# EasyEDA schematic SCH_acpi-pcb-design.json
TITLE: ACPI V3 - Brazalete; REV: 1.0; Date: 2026-09-23; Sheet: 1/1; Drawn By: Edy S. Avila; Company: Edy S. Avila
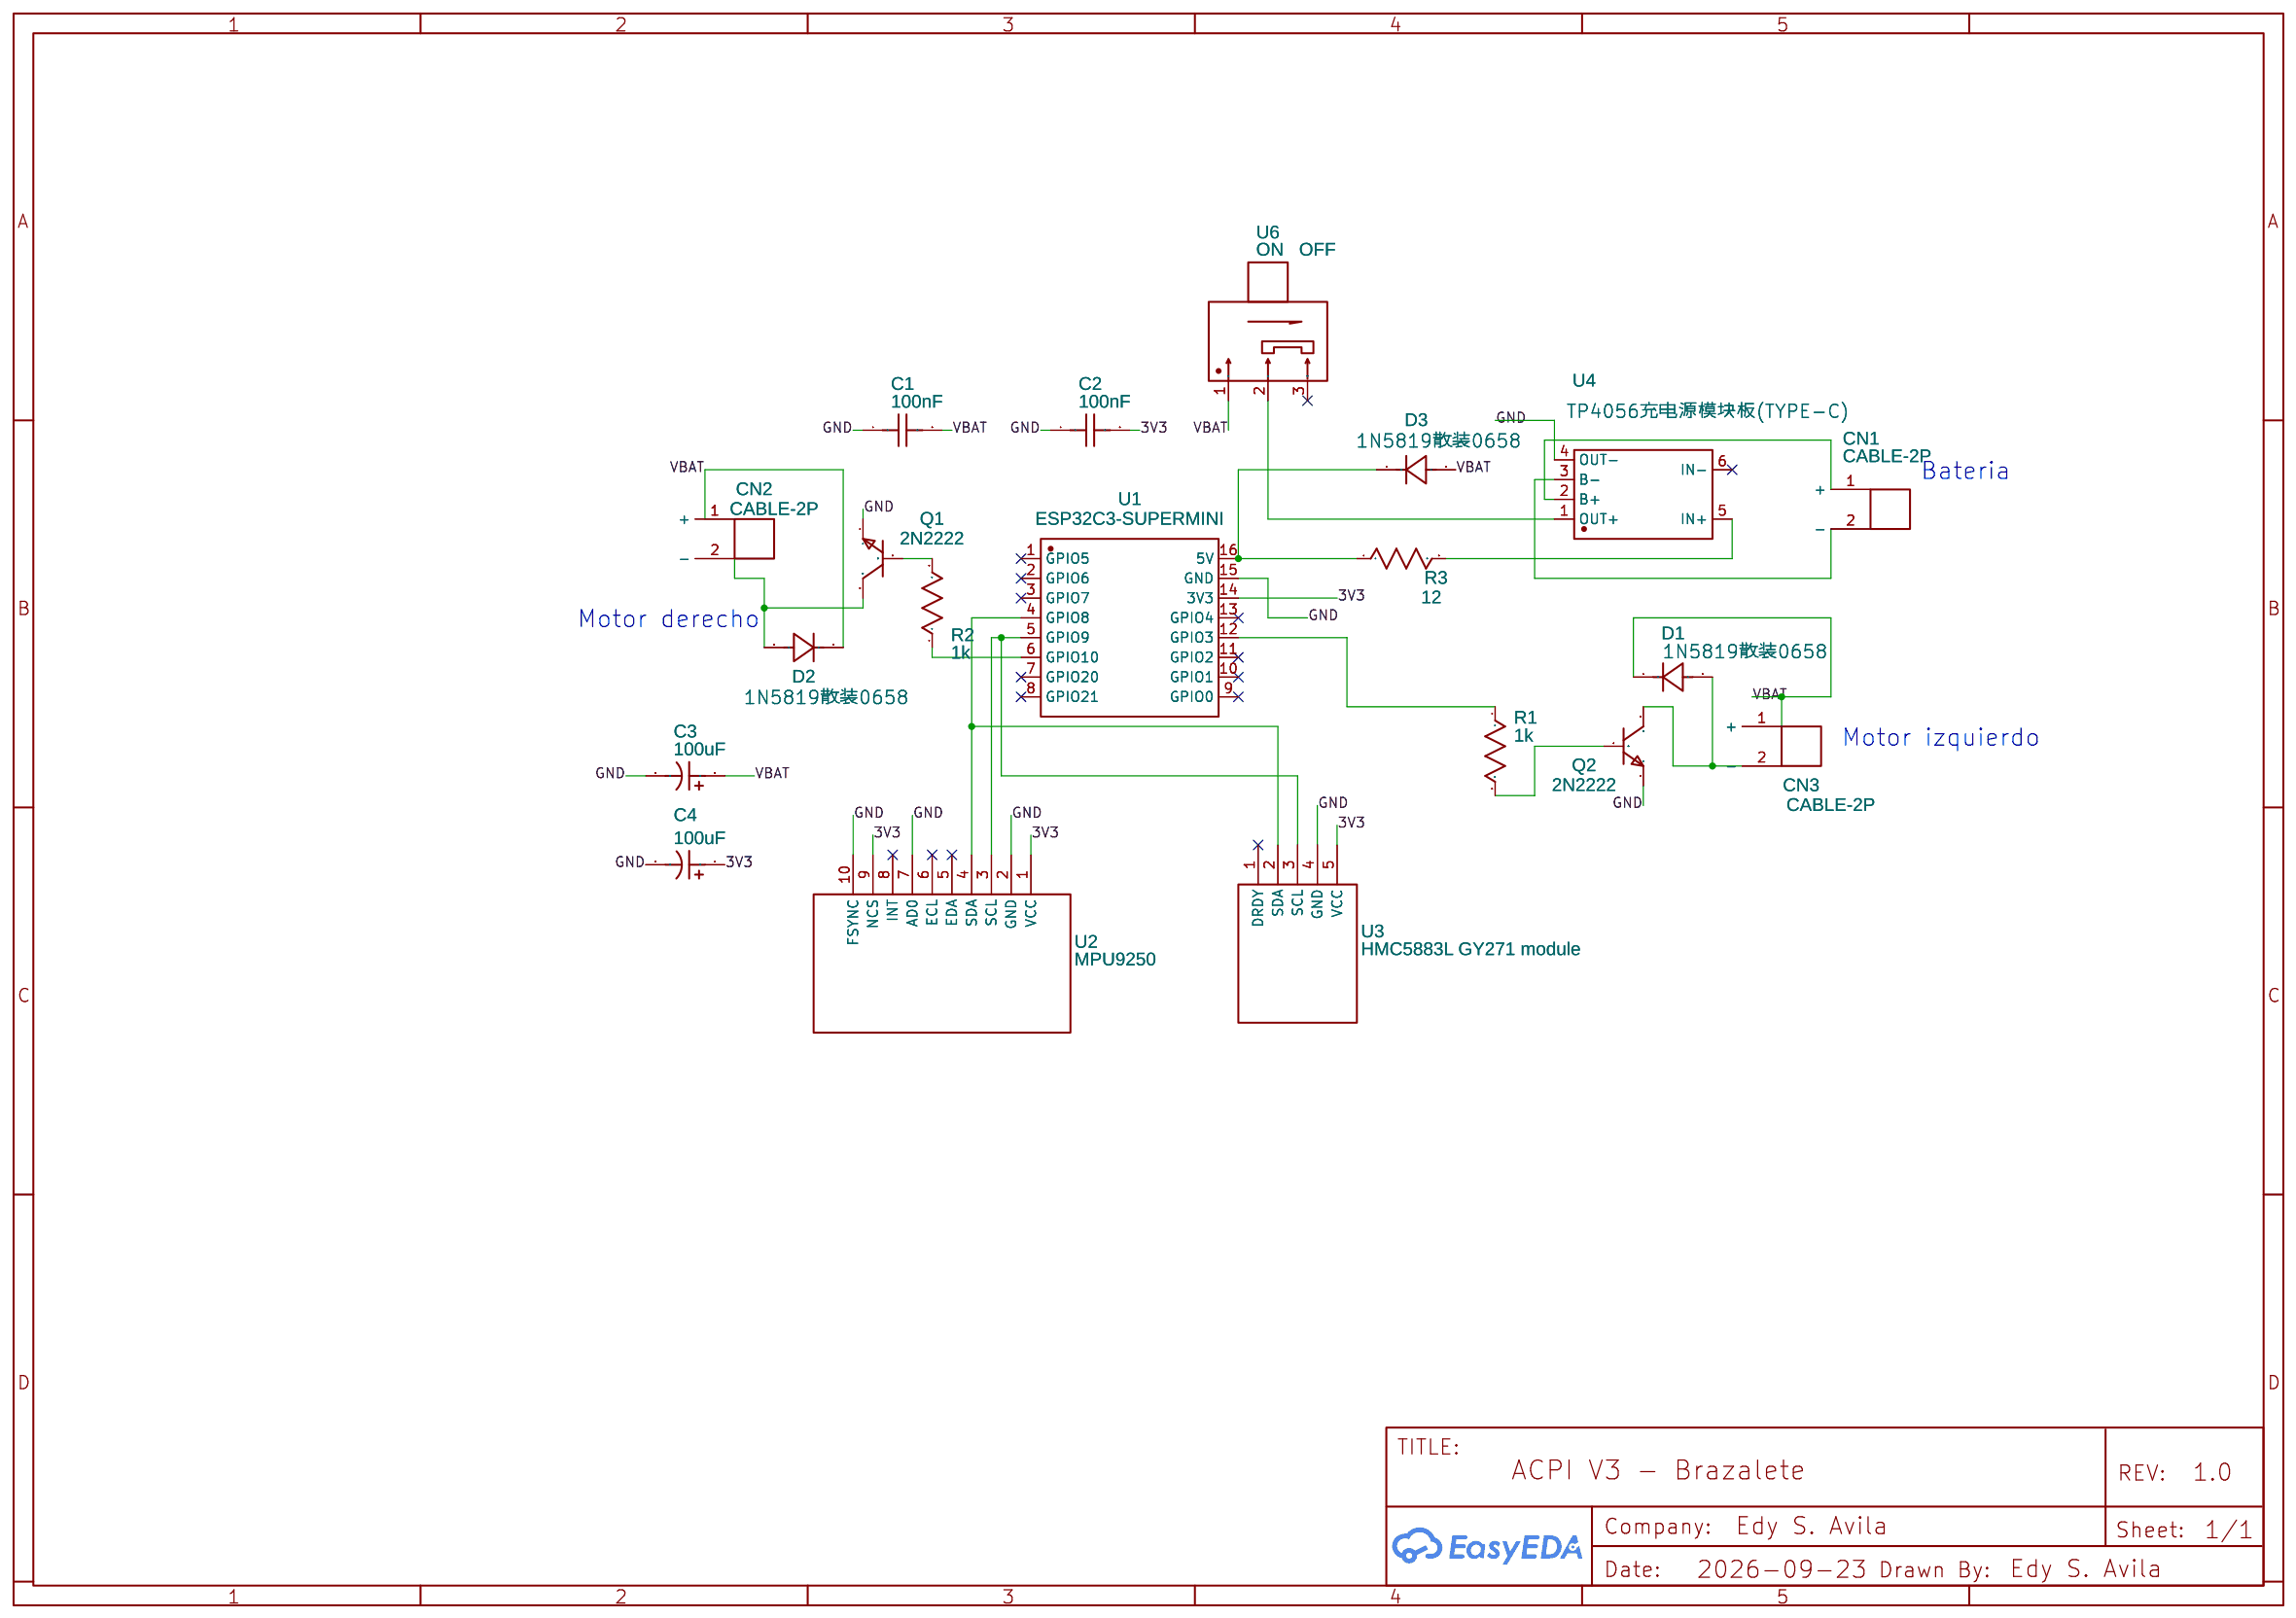
[diagram p0: schematic sheet]

## Parts
C1  100nF  [CAP-TH_L5.0-W2.5-P5.08-D0.7]
C2  100nF  [CAP-TH_L5.0-W2.5-P5.08-D0.7]
C3  100uF  [CAP-TH_BD6.3-P2.50-D0.6-FD]
C4  100uF  [CAP-TH_BD6.3-P2.50-D0.6-FD]
CN1  CABLE-2P  [CABLE-2P-P3.81]
CN2  CABLE-2P  [CABLE-2P-P3.81]
CN3  CABLE-2P  [CABLE-2P-P3.81]
D1  1N5819散装0658  [DO-41_BD2.4-L4.7-P8.70-D0.9-RD]
D2  1N5819散装0658  [DO-41_BD2.4-L4.7-P8.70-D0.9-RD]
D3  1N5819散装0658  [DO-41_BD2.4-L4.7-P8.70-D0.9-RD]
Q1  2N2222  [TO-92-P2.54-CASERA]
Q2  2N2222  [TO-92-P2.54-CASERA]
R1  1k  [R_AXIAL-0.3]
R2  1k  [R_AXIAL-0.3]
R3  12  [R_AXIAL-0.5]
U1  ESP32C3-SUPERMINI  [ESP32C3-SUPERMINI-THT]
U2  MPU9250  [MPU9250]
U3  HMC5883L GY271 module  [HMC5883L GY271 MODULE]
U4  TP4056充电源模块板(TYPE-C)  [PWRM-TH_TP4056]
U6  ON   OFF  [SW-TH_SS12D00G4]

## Library data of the parts
C1 C2 = CC2A104ZC1ID3F7C30MF: Contributor: LCSC; Supplier: LCSC; Supplier Part: C254109; Manufacturer: Dersonic(德尔创); JLCPCB Part Class: Extended Part
C3 C4 = OLKC1102A220MF: Supplier: LCSC; Supplier Part: C19193647; Manufacturer: Ymin(永铭); Contributor: lcsc
CN1-CN3 = CABLE-2P: Contributor: sant85082
D1-D3 = 1N5819散装0658: Supplier: LCSC; Supplier Part: C2906380; Manufacturer: YFW(佑风微); JLCPCB Part Class: Extended Part; Contributor: lcsc
Q1 Q2 = 2N2222: Contributor: LCSC; Supplier: LCSC; Manufacturer: ST(先科); Manufacturer Part: 2N2222A; Supplier Part: C118536; JLCPCB Part Class: Extended Part
R1-R3 = resistence: Contributor: nixfix; subpart_no: 1
U1 = ESP32C3-SUPERMINI: Supplier: LCSC; Supplier Part: C9900147397; Manufacturer: null; Manufacturer Part: ESP32C3-SuperMini; JLCPCB Part Class: Extended Part; Contributor: sant85082
U2 = MPU9250: Contributor: sant85082
U3 = HMC5883L GY271 module: Contributor: memelinking; sourceId: G2Wd7pHZT
U4 = TP4056充电源模块板(TYPE-C): Supplier: LCSC; Supplier Part: C9900049108; Manufacturer: null; Manufacturer Part: TP4056充电源模块板(Type-C); JLCPCB Part Class: Extended Part; Contributor: lcsc
U6 = SS12D00G4: Supplier: LCSC; Supplier Part: C50377148; Manufacturer: YIZHI(逸致); Contributor: yassinehajjout44; Package Display: No

## Nets
3V3: C2.2 C4.1 U1.14(3V3) U2.1(VCC) U2.9(NCS) U3.5(VCC)
GND: C1.1 C2.1 C3.2 C4.2 Q1.1(E) Q2.1(E) U1.15(GND) U2.2(GND) U2.7(AD0) U2.10(FSYNC) U3.4(GND) U4.4(OUT-)
VBAT: C1.2 C3.1 CN2.1(+) CN3.1(+) D1.1(K) D2.1(K) D3.2(A) U6.1
Net-(CN1-1): CN1.1(+) U4.2(B+)
Net-(CN1-2): CN1.2(-) U4.3(B-)
Net-(CN2-2): CN2.2(-) D2.2(A) Q1.3(C)
Net-(CN3-2): CN3.2(-) D1.2(A) Q2.3(C)
Net-(D3-1): D3.1(K) R3.1 U1.16(5V)
Net-(Q1-2): Q1.2(B) R2.2
Net-(Q2-2): Q2.2(B) R1.2
Net-(R1-1): R1.1 U1.12(GPIO3)
Net-(R2-1): R2.1 U1.6(GPIO10)
Net-(R3-2): R3.2 U4.5(IN+)
Net-(U1-4): U1.4(GPIO8) U2.4(SDA) U3.2(SDA)
Net-(U1-5): U1.5(GPIO9) U2.3(SCL) U3.3(SCL)
Net-(U4-1): U4.1(OUT+) U6.2

Not connected (* = marked no-connect by the designer): U1 1(GPIO5)* 2(GPIO6)* 3(GPIO7)* 7(GPIO20)* 8(GPIO21)* 9(GPIO0)* 10(GPIO1)* 11(GPIO2)* 13(GPIO4)*; U2 5(EDA)* 6(ECL)* 8(INT)*; U3 1(DRDY)*; U4 6(IN-)*; U6 3*

## Notes on the sheet
- Bateria
- Motor derecho
- Motor izquierdo
